# EAGLE design ArduSense_V0_3_5 (EAGLE 7.2.0)
AUTHOR: Joaquin Vaquero
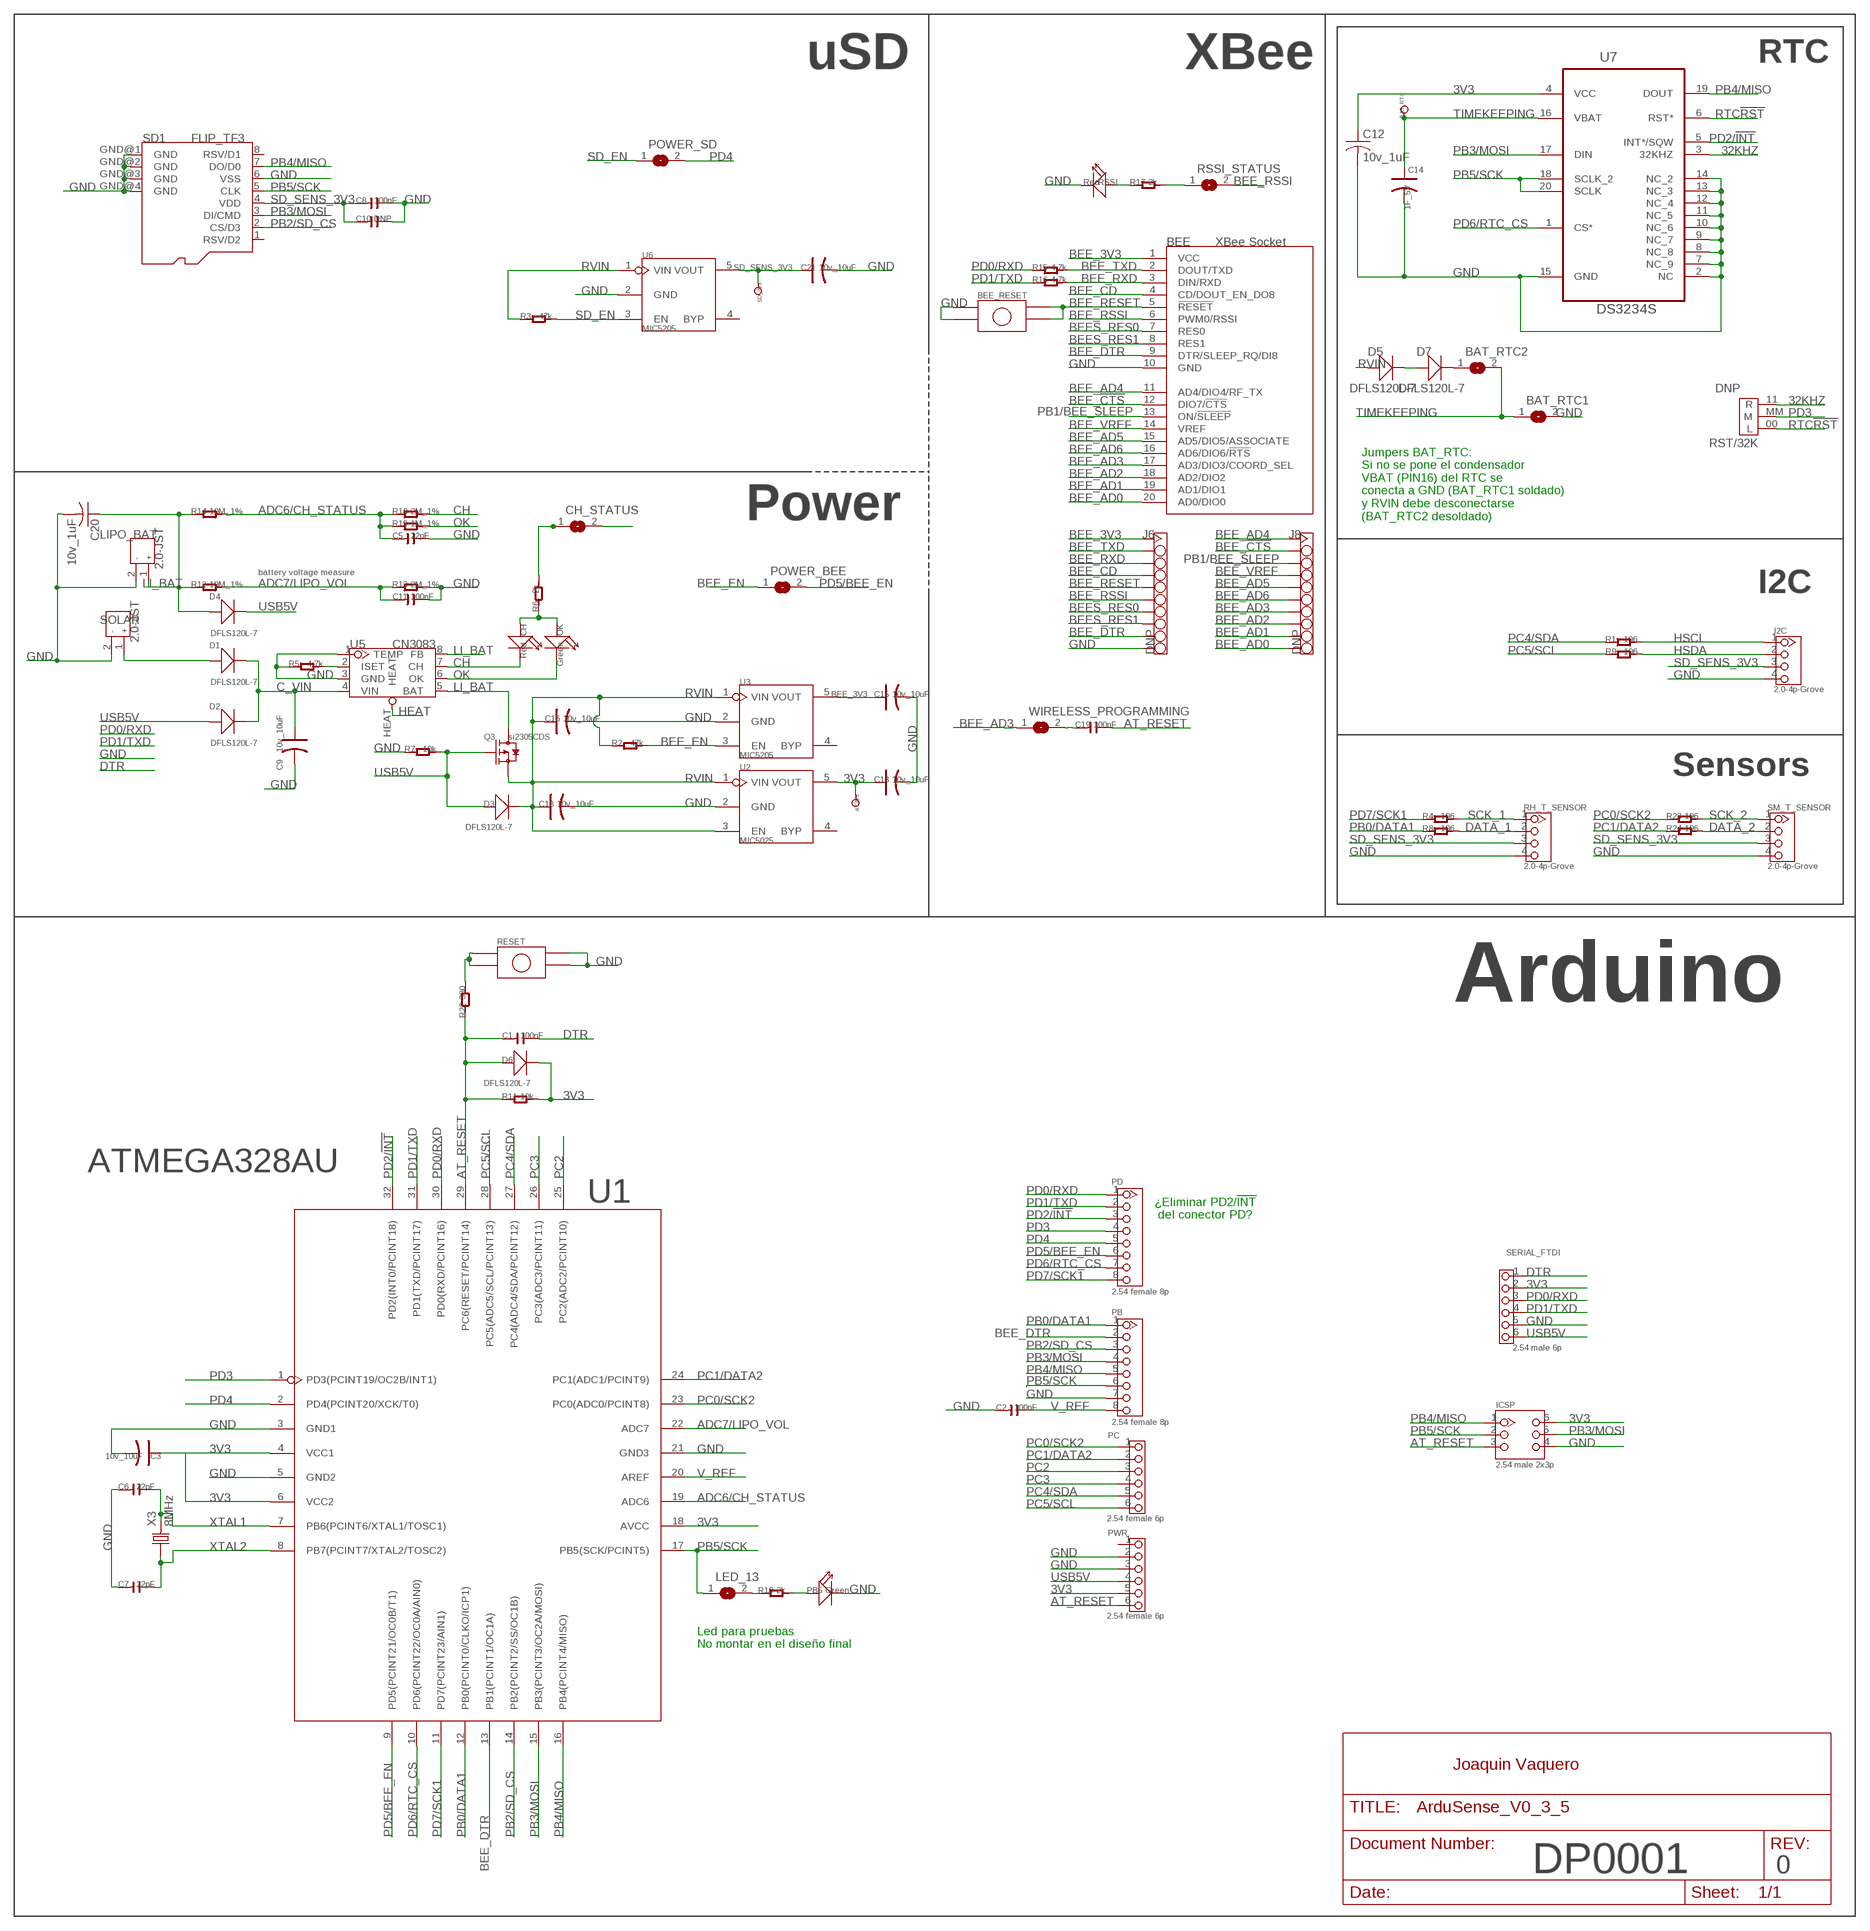
[diagram p0: schematic, sheet 1]

## Parts
AT3V3  DNP  TEST_POINT_SIZE_3030  [TP_3535]
BAT_RTC  DNP  TEST_POINT_SIZE_3030  [TP_3535]
BAT_RTC1  SJ  [SJ]
BAT_RTC2  SJ  [SJ]
BEE  XBee Socket  BEEO  [BEE]
BEE_RESET  PUSH_BUTTON  [PBUTTON_SMD]
C1  100nF  C-1206  [C1206]
C2  100nF  C-1206  [C1206]
C3  10v_10uF  C-POLAR-A  [AVX-A]
C5  22pF  C-1206  [C1206]
C6  22pF  C-1206  [C1206]
C7  22pF  C-1206  [C1206]
C8  100nF  C-1206  [C1206]
C9  10v_10uF  C-POLAR-A  [AVX-A]
C10  DNP  C-1206  [C1206]
C11  100nF  C-1206  [C1206]
C12  10v_1uF  C-USC0805  [C0805]
C13  10v_10uF  C-POLAR-A  [AVX-A]
C14  1F_5V  C-POLAR-DP  [EB21,5D]
C15  10v_10uF  C-POLAR-A  [AVX-A]
C16  10v_10uF  C-POLAR-A  [AVX-A]
C18  10v_10uF  C-POLAR-A  [AVX-A]
C19  100nF  C-1206  [C1206]
C20  10v_1uF  C-USC0805  [C0805]
C21  10v_10uF  C-POLAR-A  [AVX-A]
CH  Red  007-LED1206  [D1206]
CH_STATUS  SJ  [SJ]
D1  DFLS120L-7  DPOWERDI123  [POWERDI123]
D2  DFLS120L-7  DPOWERDI123  [POWERDI123]
D3  DFLS120L-7  DPOWERDI123  [POWERDI123]
D4  DFLS120L-7  DPOWERDI123  [POWERDI123]
D5  DFLS120L-7  DPOWERDI123  [POWERDI123]
D6  DFLS120L-7  DPOWERDI123  [POWERDI123]
D7  DFLS120L-7  DPOWERDI123  [POWERDI123]
I2C  2.0-4p-Grove  TWIG-4P-2.0-2.0  [4P-2.0]
ICSP  2.54 male 2x3p  HEADER-2X3P-2.54  [2X3P-2.54-LEADED]
J6  DNP  HEADER_1X10DD  [HEADER_1X10]
J8  DNP  HEADER_1X10DD  [HEADER_1X10]
LED_13  SJ  [SJ]
LIPO_BAT  2.0-JST  JACK-JST-2P-PW2.0  [JST-2.0]
OK  Green  007-LED1206  [D1206]
PB  2.54 female 8p  HEADER-8P-2.54-LEADED  [8P-2.54-LEADED]
PB5  Green  007-LED1206  [D1206]
PC  2.54 female 6p  HEADER-6P-LEADED-2.54  [6P-2.54-LEADED]
PD  2.54 female 8p  HEADER-8P-2.54-LEADED  [8P-2.54-LEADED]
POWER_BEE  SJ  [SJ]
POWER_SD  SJ  [SJ]
PWR  2.54 female 6p  HEADER-6P-LEADED-2.54  [6P-2.54-LEADED]
Q3  si2305CDS  MOSFET-P-044021001  [SOT23]
R1  196  R-1206  [R1206]
R2  47k  R-1206  [R1206]
R3  47k  R-1206  [R1206]
R4  196  R-1206  [R1206]
R5  4.7k  R-1206  [R1206]
R6  2k  R-1206  [R1206]
R7  10k  R-1206  [R1206]
R8  196  R-1206  [R1206]
R9  196  R-1206  [R1206]
R10  2k  R-1206  [R1206]
R11  10k  R-1206  [R1206]
R12  10M_1%  R-1206  [R1206]
R13  2M_1%  R-1206  [R1206]
R14  10M_1%  R-1206  [R1206]
R15  4.7k  R-1206  [R1206]
R16  4.7k  R-1206  [R1206]
R17  2k  R-1206  [R1206]
R18  2M_1%  R-1206  [R1206]
R19  1M_1%  R-1206  [R1206]
R22  330  R-1206  [R1206]
R23  196  R-1206  [R1206]
R24  196  R-1206  [R1206]
RESET  PUSH_BUTTON  [PBUTTON_SMD]
RH_T_SENSOR  2.0-4p-Grove  TWIG-4P-2.0-2.0  [4P-2.0]
RSSI  Red  007-LED1206  [D1206]
RSSI_STATUS  SJ  [SJ]
RST/32K  DNP  JUMPER  [JUMPER]
SD1  FLIP_TF3  [FLIP_TF3]
SD_3V3  DNP  TEST_POINT_SIZE_3030  [TP_3535]
SERIAL_FTDI  2.54 male 6p  HEADER-6P-LEADED-2.54  [6P-2.54-LEADED]
SM_T_SENSOR  2.0-4p-Grove  TWIG-4P-2.0-2.0  [4P-2.0]
SOLAR  2.0-JST  JACK-JST-2P-PW2.0  [JST-2.0]
U1  ATMEGA328AU  ATMEGA168-20AU  [ATMEGA168-20AU]
U2  MIC5025  MIC5025_X.X  [SOT23-5]
U3  MIC5205  MIC5025_X.X  [SOT23-5]
U5  CN3083  [SOP8]
U6  MIC5205  MIC5025_X.X  [SOT23-5]
U7  DS3234S  [SOIC127P1032X265-20N]
WIRELESS_PROGRAMMING  SJ  [SJ]
X3  8MHz  011-CRYSTALHC49UP  [HC49UP]

## Nets
3V3: AT3V3.T C3.+ C12.1 C13.+ D6.- ICSP.6 PWR.5 R11.2 SERIAL_FTDI.2 U1.4(VCC1) U1.6(VCC2) U1.18(AVCC) U2.5(VOUT) U7.4(VCC)
32KHZ: RST/32K.11(R) U7.3(32KHZ)
ADC6/CH_STATUS: C5.1 R14.2 R18.1 R19.1 U1.19(ADC6)
ADC7/LIPO_VOL: C11.1 R12.2 R13.1 U1.22(ADC7)
AT_RESET: C1.1 C19.2 D6.+ ICSP.3 PWR.6 R11.1 R22.1 U1.29(PC6(RESET/PCINT14))
BEE_3V3: BEE.1(VCC) C15.+ J6.1 U3.5(VOUT)
BEE_!CTS: BEE.12(DIO7/!CTS) J8.2
BEE_AD0: BEE.20(AD0/DIO0) J8.10
BEE_AD1: BEE.19(AD1/DIO1) J8.9
BEE_AD2: BEE.18(AD2/DIO2) J8.8
BEE_AD3: BEE.17(AD3/DIO3/COORD_SEL) J8.7 WIRELESS_PROGRAMMING.1
BEE_AD4: BEE.11(AD4/DIO4/RF_TX) J8.1
BEE_AD5: BEE.15(AD5/DIO5/ASSOCIATE) J8.5
BEE_AD6: BEE.16(AD6/DIO6/!RTS) J8.6
BEE_CD: BEE.4(CD/DOUT_EN_DO8) J6.4
BEE_DTR: BEE.9(DTR/SLEEP_RQ/DI8) J6.9 PB.2 U1.13(PB1(PCINT1/OC1A))
BEE_EN: POWER_BEE.1 R2.2 U3.3(EN)
BEE_RESET: BEE.5(!RESET) BEE_RESET.3 BEE_RESET.4 J6.5
BEE_RSSI: BEE.6(PWM0/RSSI) J6.6 RSSI_STATUS.2
BEE_RXD: BEE.3(DIN/RXD) J6.3 R16.2
BEE_TXD: BEE.2(DOUT/TXD) J6.2 R15.2
BEE_VREF: BEE.14(VREF) J8.4
BEES_RES0: BEE.7(RES0) J6.7
BEES_RES1: BEE.8(RES1) J6.8
C_VIN: C9.+ CH_STATUS.2 D1.- D2.- U5.4(VIN)
CH: CH.- R18.2 U5.7(CH)
DATA_1: R8.2 RH_T_SENSOR.2
DATA_2: R24.2 SM_T_SENSOR.2
DTR: C1.2 SERIAL_FTDI.1
GND: BAT_RTC1.2 BEE.10(GND) BEE_RESET.1 BEE_RESET.2 C2.1 C3.- C5.2 C6.1 C7.1 C8.2 C9.- C10.2 C11.2 C12.6+ C13.- C14.- C15.- C16.- C18.- C20.6+ C21.- I2C.4 ICSP.4 J6.10 LIPO_BAT.2 PB5.- PB.7 PWR.2 PWR.3 R5.1 R7.1 R13.2 RESET.3 RESET.4 RH_T_SENSOR.4 RSSI.- SD1.6(VSS) SD1.GND@1(GND) SD1.GND@2(GND) SD1.GND@3(GND) SD1.GND@4(GND) SERIAL_FTDI.5 SM_T_SENSOR.4 SOLAR.2 U1.3(GND1) U1.5(GND2) U1.21(GND3) U2.2(GND) U3.2(GND) U5.1(TEMP) U5.3(GND) U6.2(GND) U7.2(NC) U7.7(NC_9) U7.8(NC_8) U7.9(NC_7) U7.10(NC_6) U7.11(NC_5) U7.12(NC_4) U7.13(NC_3) U7.14(NC_2) U7.15(GND)
HEAT: U5.HEAT
HSCL: I2C.1 R1.2
HSDA: I2C.2 R9.2
LI_BAT: C20.1 D4.+ LIPO_BAT.1 Q3.3(D) R12.1 R14.1 U5.5(BAT) U5.8(FB)
N$1: PB5.+ R10.2
N$2: D5.- D7.+
N$3: D1.+ SOLAR.1
N$4: R22.2 RESET.1 RESET.2
N$5: R5.2 U5.2(ISET)
N$6: R17.1 RSSI.+
N$7: R17.2 RSSI_STATUS.1
N$8: CH.+ OK.+ R6.1
N$9: BAT_RTC2.1 D7.-
N$10: C19.1 WIRELESS_PROGRAMMING.2
N$11: LED_13.2 R10.1
N$12: CH_STATUS.1 R6.2
OK: OK.- R19.2 U5.6(OK)
PB0/DATA1: PB.1 R8.1 U1.12(PB0(PCINT0/CLKO/ICP1))
PB1/BEE_SLEEP: BEE.13(ON/!SLEEP) J8.3
PB2/SD_CS: PB.3 SD1.2(CS/D3) U1.14(PB2(PCINT2/SS/OC1B))
PB3/MOSI: ICSP.5 PB.4 SD1.3(DI/CMD) U1.15(PB3(PCINT3/OC2A/MOSI)) U7.17(DIN)
PB4/MISO: ICSP.1 PB.5 SD1.7(DO/D0) U1.16(PB4(PCINT4/MISO)) U7.19(DOUT)
PB5/SCK: ICSP.2 LED_13.1 PB.6 SD1.5(CLK) U1.17(PB5(SCK/PCINT5)) U7.18(SCLK_2) U7.20(SCLK)
PC0/SCK2: PC.1 R23.1 U1.23(PC0(ADC0/PCINT8))
PC1/DATA2: PC.2 R24.1 U1.24(PC1(ADC1/PCINT9))
PC2: PC.3 U1.25(PC2(ADC2/PCINT10))
PC3: PC.4 U1.26(PC3(ADC3/PCINT11))
PC4/SDA: PC.5 R1.1 U1.27(PC4(ADC4/SDA/PCINT12))
PC5/SCL: PC.6 R9.1 U1.28(PC5(ADC5/SCL/PCINT13))
PD0/RXD: PD.1 R15.1 SERIAL_FTDI.3 U1.30(PD0(RXD/PCINT16))
PD1/TXD: PD.2 R16.1 SERIAL_FTDI.4 U1.31(PD1(TXD/PCINT17))
PD2/!INT: PD.3 U1.32(PD2(INT0/PCINT18)) U7.5(INT*/SQW)
PD3: PD.4 RST/32K.MM(M) U1.1(PD3(PCINT19/OC2B/INT1))
PD4: PD.5 POWER_SD.2 U1.2(PD4(PCINT20/XCK/T0))
PD5/BEE_EN: PD.6 POWER_BEE.2 U1.9(PD5(PCINT21/OC0B/T1))
PD6/RTC_CS: PD.7 U1.10(PD6(PCINT22/OC0A/AIN0)) U7.1(CS*)
PD7/SCK1: PD.8 R4.1 U1.11(PD7(PCINT23/AIN1))
RTC!RST: RST/32K.00(L) U7.6(RST*)
RVIN: C16.+ C18.+ D3.- D5.+ Q3.2(S) R2.1 R3.1 U2.1(VIN) U2.3(EN) U3.1(VIN) U6.1(VIN)
SCK_1: R4.2 RH_T_SENSOR.1
SCK_2: R23.2 SM_T_SENSOR.1
SD_EN: POWER_SD.1 R3.2 U6.3(EN)
SD_SENS_3V3: C8.1 C10.1 C21.+ I2C.3 RH_T_SENSOR.3 SD1.4(VDD) SD_3V3.T SM_T_SENSOR.3 U6.5(VOUT)
TIMEKEEPING: BAT_RTC1.1 BAT_RTC2.2 BAT_RTC.T C14.+ U7.16(VBAT)
USB5V: D2.+ D3.+ D4.- PWR.4 Q3.1(G) R7.2 SERIAL_FTDI.6
V_REF: C2.2 PB.8 U1.20(AREF)
XTAL1: C6.2 U1.7(PB6(PCINT6/XTAL1/TOSC1)) X3.2
XTAL2: C7.2 U1.8(PB7(PCINT7/XTAL2/TOSC2)) X3.1
Unconnected: PWR.1 SD1.1(RSV/D2) SD1.8(RSV/D1) U2.4(BYP) U3.4(BYP) U6.4(BYP)

## Notes on the sheet
- uSD | XBee | RTC
- Power
- Jumpers BAT_RTC:
  Si no se pone el condensador 
  VBAT (PIN16) del RTC se 
  conecta a GND (BAT_RTC1 soldado)
  y RVIN debe desconectarse
  (BAT_RTC2 desoldado)
- battery voltage measure
- I2C
- Sensors
- Arduino
- ¿Eliminar PD2/!INT
   del conector PD?
- Led para pruebas
  No montar en el diseño final
- DP0001 | 0

## Library data of the parts
AT3V3 BAT_RTC SD_3V3 = CEI_Bio_Tic:TEST_POINT
BAT_RTC1 BAT_RTC2 CH_STATUS LED_13 POWER_BEE POWER_SD RSSI_STATUS WIRELESS_PROGRAMMING = jumper:SJ: SMD solder JUMPER
BEE = CEI_Bio_Tic:BEE
BEE_RESET RESET = CEI_Bio_Tic:PUSH_BUTTON
C1 C2 C5-C8 C10 C11 C19 = CEI_Bio_Tic:C*
C3 C9 C13-C16 C18 C21 = CEI_Bio_Tic:C-POLAR*
C12 C20 = rcl:C-US: CAPACITOR, American symbol
CH OK PB5 RSSI = CEI_Bio_Tic:007-LED*
D1-D7 = CEI_Bio_Tic:D*: DIODE
I2C RH_T_SENSOR SM_T_SENSOR = CEI_Bio_Tic:TWIG-4P-2.0
ICSP = CEI_Bio_Tic:HEADER-2X3P
J6 J8 = CEI_Bio_Tic:HEADER_1X10
LIPO_BAT SOLAR = CEI_Bio_Tic:JACK-JST-2P-PW
PB PD = CEI_Bio_Tic:HEADER-8P
PC PWR SERIAL_FTDI = CEI_Bio_Tic:HEADER-6P
Q3 = CEI_Bio_Tic:MOSFET-P: CJ2305:SMD MOSFET P-CH 8V-4.1A
R1-R19 R22-R24 = CEI_Bio_Tic:R*
RST/32K = CEI_Bio_Tic:JUMPER
SD1 = CEI_Bio_Tic:FLIP_TF3
U1 = CEI_Bio_Tic:ATMEGA168-20AU
U2 U3 U6 = CEI_Bio_Tic:MIC5025_X.X
U5 = CEI_Bio_Tic:CN3083
U7 = CEI_Bio_Tic:DS3234S: Extremely Accurate SPI Bus RTC with Integrated Crystal and SRAM; MPN: DS3234S#; OC_FARNELL: 1593294; OC_NEWARK: 74K5054; PACKAGE: SOIC-20; SUPPLIER: MAXIM INTEGRATED PRODUCTS
X3 = CEI_Bio_Tic:011-CRYSTAL*: CRYSTAL

## Net classes
0 default: width 0.152 mm, drill 0.305 mm, clearance 0.152 mm

## Board
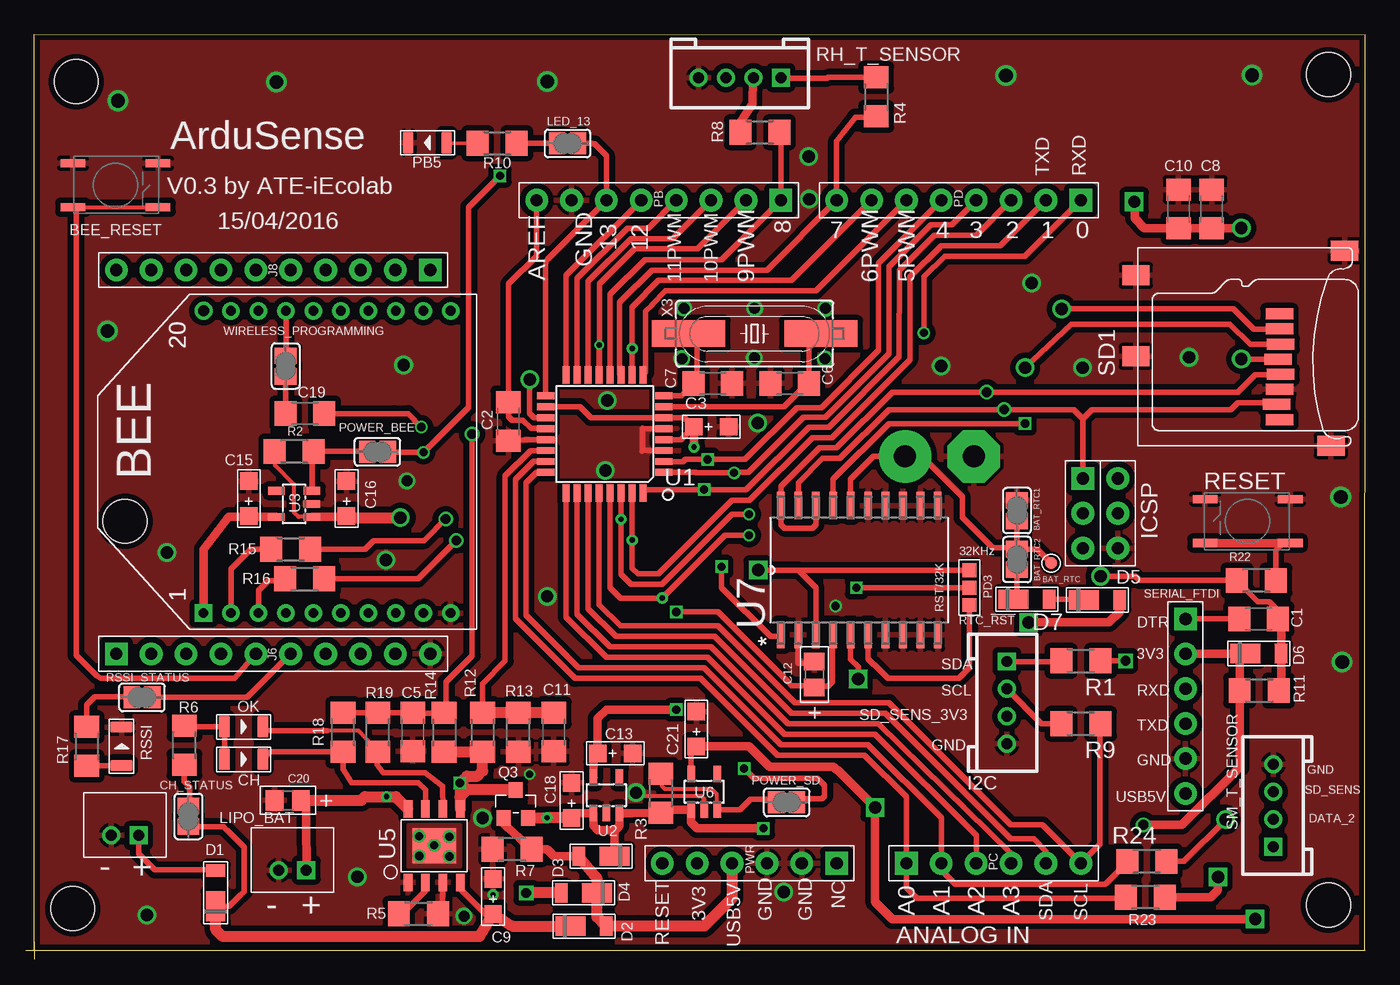
[diagram p1: board, top side]
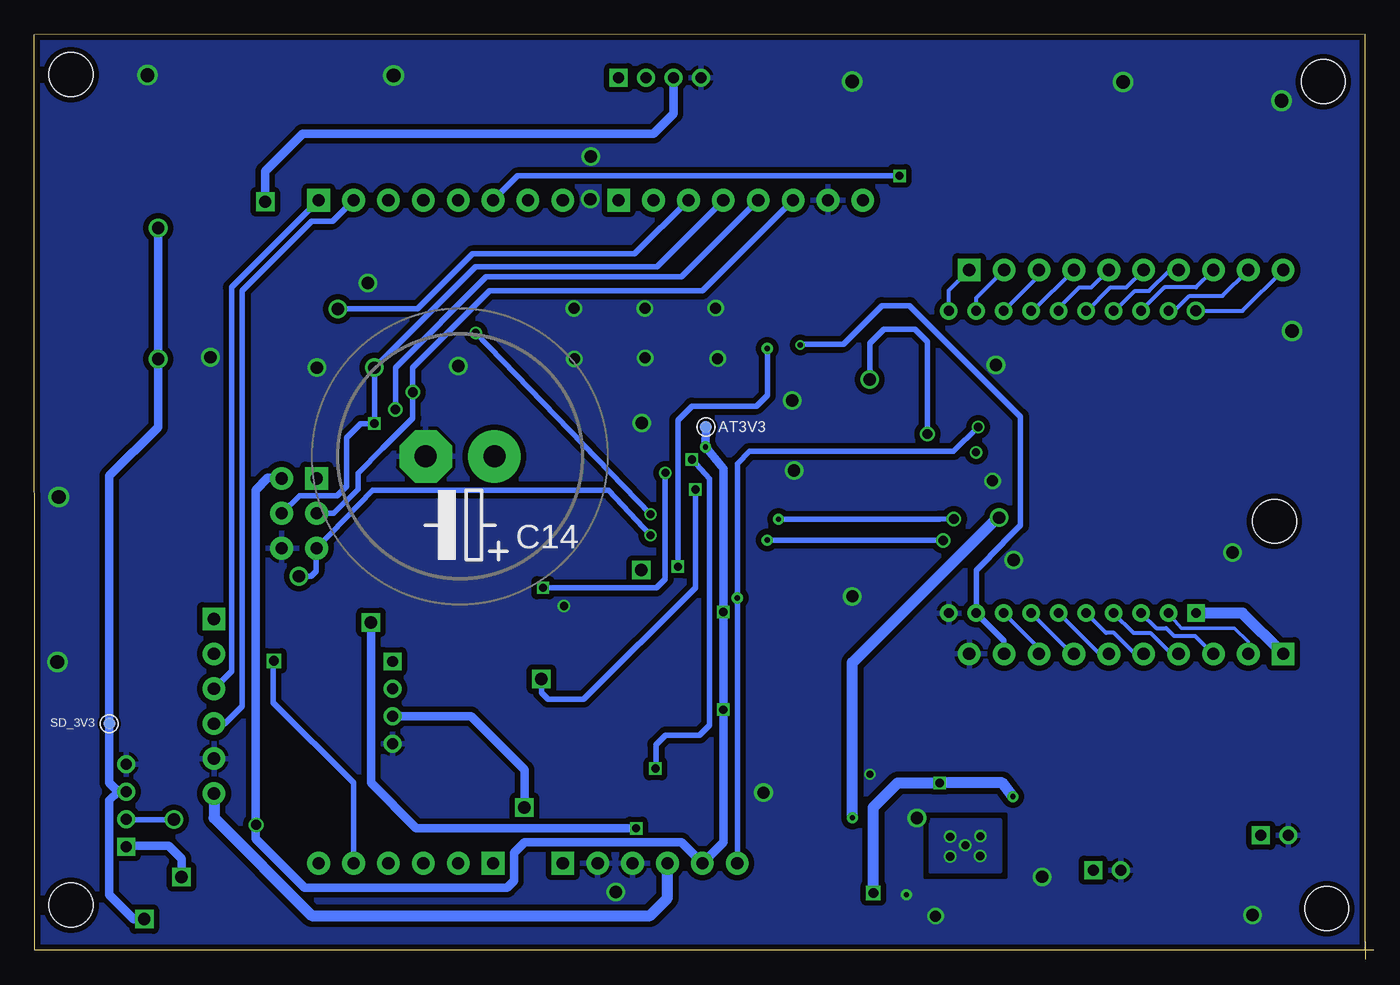
[diagram p2: board, bottom side, seen from below]

Size 96.9 x 66.68 mm. Coordinates in mm from the lower left corner, seen from the top.
Outline: 96.9,66.66 0,66.68 0,0 96.89,0
Outline: 96.89,0 96.9,66.65
Outline: 96.89,0 96.9,0
Copper layers (1*16): Top 0.035mm / dielectric 1.5mm / Bottom 0.035mm
Design rules "para fabricacion externa de 6mm": minimum track width 6mil, minimum drill 12mil, track to track 6mil, track to pad 6mil, pad to pad 6mil, via to via 6mil, smd to smd 0mil, copper to edge 10mil, drill to drill 10mil, minimum pad ring 10mil, minimum via ring 6mil, stop-mask expansion 2mil, vias tented up to drill 100mil, thermal gap 10mil
Holes 3.2 mm at 94.23,63.75 3.05,63.25 2.79,3.05 6.6,31.24 94.23,3.3
Milling: 2 lines

### Footprints (pad centres in the part's own frame; a part is rotated, then mirrored left to right if it is on the bottom)
TP_3535 = smd 0.889 x 0.889: T 0,0
SJ = smd 1.168 x 1.6: 1 -0.762,0; 2 0.762,0
BEE = drill 0.711 pad 1.27 square: 1 -11,0 | drill 0.711 pad 1.27: 2 -11,-2; 3 -11,-4; 4 -11,-6; 5 -11,-8; 6 -11,-10; 7 -11,-12; 8 -11,-14; 9 -11,-16; 10 -11,-18; 11 11,-18; 12 11,-16; 13 11,-14; 14 11,-12; 15 11,-10; 16 11,-8; 17 11,-6; 18 11,-4; 19 11,-2 | drill 0.8 pad 1.27: 20 11,0
PBUTTON_SMD = smd 1.8 x 0.6: 1 -3.1,-1.6; 2 3.1,-1.6; 3 -3.1,1.6; 4 3.1,1.6
C1206 = smd 1.6 x 1.8: 1 -1.4,0; 2 1.4,0
AVX-A = smd 1.27 x 1.27: + -1.27,0; - 1.27,0
C0805 = smd 1.3 x 1.5: 1 -0.95,0; 6+ 0.95,0
EB21,5D = drill 1.6 pad 3.81: + -2.5,0 | drill 1.6 pad 3.81 octagon: - 2.5,0
D1206 = smd 0.8 x 1.6: + -1.4,0; - 1.4,0
POWERDI123 = smd 0.9 x 1.4: + -1,0 | smd 2.2 x 1.4: - 1.6,0
4P-2.0 = drill 0.8 pad 1.27 square: 1 -3,0 | drill 0.8 pad 1.27: 2 -1,0; 3 1,0; 4 3,0
2X3P-2.54-LEADED = drill 0.889 pad 1.651 square: 1 -1.27,2.54 | drill 0.889 pad 1.651: 2 -1.27,0; 3 -1.27,-2.54; 4 1.27,-2.54; 5 1.27,0; 6 1.27,2.54
HEADER_1X10 = drill 0.889 pad 1.651 square: 1 0,11.43 | drill 0.889 pad 1.651: 2 0,8.89; 3 0,6.35; 4 0,3.81; 5 0,1.27; 6 0,-1.27; 7 0,-3.81; 8 0,-6.35; 9 0,-8.89; 10 0,-11.43
JST-2.0 = drill 0.8 pad 1.3 square: 1 -1,0.75 | drill 0.8 pad 1.3: 2 1,0.75
8P-2.54-LEADED = drill 0.889 pad 1.651 square: 1 0,8.89 | drill 0.889 pad 1.651: 2 0,6.35; 3 0,3.81; 4 0,1.27; 5 0,-1.27; 6 0,-3.81; 7 0,-6.35; 8 0,-8.89
6P-2.54-LEADED = drill 0.889 pad 1.651 square: 1 0,6.35 | drill 0.889 pad 1.651: 2 0,3.81; 3 0,1.27; 4 0,-1.27; 5 0,-3.81; 6 0,-6.35
SOT23 = smd 1.016 x 1.143: 1 -0.889,-1.016; 2 0.889,-1.016; 3 0,1.016
R1206 = smd 1.6 x 1.803: 1 -1.422,0; 2 1.422,0
JUMPER = smd 1.016 x 1.016: 00 -1.27,0; 11 1.27,0; MM 0,0
FLIP_TF3 = smd 0.8 x 2: 1 2.4,-2.39; 2 1.3,-2.39; 3 0.2,-2.49; 4 -0.9,-2.29; 5 -2,-2.49; 6 -3.1,-2.39; 7 -4.2,-2.19; 8 -5.3,-2.39 | smd 1.45 x 2: GND@1 -0.7,8.06; GND@2 -7.2,-6.14; GND@3 7,-7.14; GND@4 5.2,8.06
ATMEGA168-20AU = smd 1.27 x 0.508: 1 -4.293,2.8; 2 -4.293,2; 3 -4.293,1.2; 4 -4.293,0.4; 5 -4.293,-0.4; 6 -4.293,-1.2; 7 -4.293,-2; 8 -4.293,-2.8; 17 4.293,-2.8; 18 4.293,-2; 19 4.293,-1.2; 20 4.293,-0.4; 21 4.293,0.4; 22 4.293,1.2; 23 4.293,2; 24 4.293,2.8 | smd 0.508 x 1.27: 9 -2.8,-4.293; 10 -2,-4.293; 11 -1.2,-4.293; 12 -0.4,-4.293; 13 0.4,-4.293; 14 1.2,-4.293; 15 2,-4.293; 16 2.8,-4.293; 25 2.8,4.293; 26 2,4.293; 27 1.2,4.293; 28 0.4,4.293; 29 -0.4,4.293; 30 -1.2,4.293; 31 -2,4.293; 32 -2.8,4.293
SOT23-5 = smd 0.55 x 1.2: 1 -0.95,-1.3; 2 0,-1.3; 3 0.95,-1.3; 4 0.95,1.3; 5 -0.95,1.3
SOP8 = smd 0.635 x 1.27: 1 -1.905,-2.667; 2 -0.635,-2.667; 3 0.635,-2.667; 4 1.905,-2.667; 5 1.905,2.667; 6 0.635,2.667; 7 -0.635,2.667; 8 -1.905,2.667 | smd 3.175 x 2.54: HEAT 0,0
SOIC127P1032X265-20N = smd 1.981 x 0.559: 1 -4.699,5.715; 2 -4.699,4.445; 3 -4.699,3.175; 4 -4.699,1.905; 5 -4.699,0.635; 6 -4.699,-0.635; 7 -4.699,-1.905; 8 -4.699,-3.175; 9 -4.699,-4.445; 10 -4.699,-5.715; 11 4.699,-5.715; 12 4.699,-4.445; 13 4.699,-3.175; 14 4.699,-1.905; 15 4.699,-0.635; 16 4.699,0.635; 17 4.699,1.905; 18 4.699,3.175; 19 4.699,4.445; 20 4.699,5.715
HC49UP = smd 5.334 x 1.93: 1 -4.826,0; 2 4.826,0

### Placement (x,y rotation side)
AT3V3  48.01,38.1 0 bottom
BAT_RTC  74.04,28.19 90 top
BAT_RTC1  71.56,32.02 90 top
BAT_RTC2  71.56,28.46 90 top
BEE  12.32,35.56 90 top
BEE_RESET  5.91,55.7 180 top
C1  89.15,24.13 180 top
C2  34.52,38.51 90 top
C3  49.28,38.12 0 top
C5  27.56,15.9 270 top
C6  54.99,41.27 0 top
C7  49.4,41.27 180 top
C8  85.72,53.98 90 top
C9  33.4,3.94 90 top
C10  83.31,53.98 90 top
C11  37.82,15.9 270 top
C12  56.79,20.09 90 top
C13  42.29,14.35 0 top
C14  65.91,35.97 180 bottom
C15  15.62,32.89 90 top
C16  22.73,32.89 90 top
C18  39.12,10.92 90 top
C19  19.7,39.08 0 top
C20  18.46,10.92 180 top
C21  48.2,16.12 90 top
CH  15.24,13.91 0 top
CH_STATUS  11.22,9.76 270 top
D1  13.21,4.83 270 top
D2  40.64,1.78 180 top
D3  40.64,6.86 0 top
D4  39.37,4.19 0 top
D5  78.03,25.51 180 top
D6  89.78,21.62 180 top
D7  72.9,25.56 180 top
I2C  70.82,18.03 270 top
ICSP  77.62,31.82 0 top
J6  17.4,21.59 90 top
J8  17.4,49.53 270 top
LED_13  38.82,58.74 180 top
LIPO_BAT  18.8,6.6 180 top
OK  15.24,16.28 0 top
PB  45.47,54.61 270 top
PB5  28.62,58.79 180 top
PC  69.85,6.35 90 top
PD  67.31,54.61 270 top
POWER_BEE  24.98,36.3 0 top
POWER_SD  54.78,10.78 0 top
PWR  52.07,6.35 270 top
Q3  35.05,10.67 0 top
R1  76.2,21.08 180 top
R2  18.92,36.32 0 top
R3  45.62,11.46 90 top
R4  61.3,62.13 90 top
R5  27.96,2.67 180 top
R6  10.92,14.94 270 top
R7  34.8,7.37 0 top
R8  52.83,59.56 180 top
R9  76.2,16.51 180 top
R10  33.71,58.75 180 top
R11  89.18,18.92 180 top
R12  32.64,15.88 90 top
R13  35.24,15.88 270 top
R14  29.84,15.88 90 top
R15  18.67,29.21 180 top
R16  19.68,27.05 180 top
R17  3.81,14.86 90 top
R18  22.48,15.88 270 top
R19  25.02,15.88 270 top
R22  88.99,26.93 0 top
R23  80.91,3.87 0 top
R24  81,6.48 0 top
RESET  88.34,31.25 0 top
RH_T_SENSOR  51.36,63.53 180 top
RSSI  6.35,14.86 90 top
RSSI_STATUS  7.84,18.42 0 top
RST/32K  68.1,26.42 90 top
SD1  88.27,43.94 90 top
SD_3V3  91.44,16.51 0 bottom
SERIAL_FTDI  83.82,17.78 0 top
SM_T_SENSOR  90.2,10.56 90 top
SOLAR  6.6,9.13 180 top
U1  41.53,37.59 180 top
U2  41.66,11.3 0 top
U3  18.92,32.51 90 top
U5  29.11,7.62 0 top
U6  48.77,11.56 0 top
U7  60.07,27.69 90 top
WIRELESS_PROGRAMMING  18.3,42.54 270 top
X3  52.45,44.89 0 top

### Tracks (layer width: path | path; a pad name or v marks a point on that pad's centre or on a via)
3V3  (via drill 0.38 pad 0.81, 0.6, 0.71)
  Top 0.406: U1.4 47.1,37.19 AT3V3.T 48.01,36.69 v48.04,36.66 v48.03,36.65 | U1.18 39.72,39.59 40.52,38.79 U1.6 47.34,38.79 C3.+ 48.03,38.1 | v46.74,24.64 49.78,24.64 54.86,19.56 55.14,19.28 56.77,19.28 | U7.4 58.12,22.94 58.12,19.55 57.8,19.24 57.36,19.24 | 56.87,19.24 57.36,19.24 | 57.36,19.24 57.36,19.28 56.77,19.28 | 56.77,19.28 C12.1
  Top 0.61: U2.5 40.71,14.04 C13.+ 41.02,16.89 41.66,17.53 v46.74,17.53 | 88.16,21.59 87.76,21.19 R11.2 87.76,13.34 83.57,9.14 v80.75,9.14 | 88.16,21.59 D6.- | 88.16,21.59 SERIAL_FTDI.2 | v48.03,36.65 48.03,38.1
  Bottom 0.406: ICSP.6 78.93,34.4 | 80.8,33.5 80.8,33.4 80.77,33.37
  Bottom 0.61: AT3V3.T v48.03,36.65 46.74,35.08 v46.74,24.64 v46.74,17.53 46.74,7.87 PWR.5 49.78,7.87 61.21,7.87 61.98,7.11 61.98,5.08 62.48,4.57 77.22,4.57 80.77,8.13 80.77,9.12 | 80.77,9.12 80.77,33.37 | 80.77,9.12 v80.75,9.14 | 78.93,34.4 79.9,34.4 80.8,33.5
32KHZ  (via drill 0.9)
  Top 0.406: U7.3 56.9,26.42 55.63,27.69 v52.71,27.69 RST/32K.11
ADC6/CH_STATUS  (via drill 0.71 pad 0.81, 0.9 pad 0.81)
  Top 0.406: R18.1 R19.1 C5.1 27.59,17.27 29.36,17.27 | v31.88,37.59 31.88,21.46 29.97,19.56 29.97,17.27 29.36,17.27 | v36.07,41.55 36.07,39.12 36.39,38.79 U1.19 | R14.2 29.39,17.3 29.36,17.27
  Bottom 0.305: v31.88,37.59 31.88,37.62
  Bottom 0.406: 31.88,37.62 31.88,44.32 32.77,45.21 35.05,45.21 36.07,44.2 v36.07,41.55
ADC7/LIPO_VOL
  Top 0.406: R12.2 32.64,19.43 34.29,21.08 34.29,34.54 36.14,36.39 U1.22
  Top 0.813: R12.2 R13.1 C11.1
AT_RESET  (via drill 0.38 pad 0.81, 0.6, 0.6 pad 0.41, 0.9)
  Top 0.406: C1.1 90.55,24.77 89.92,25.4 89.1,25.4 R22.1 80.47,26.93 80.16,27.24 v77.63,27.24 | U1.29 41.91,32.77 41.91,26.42 42.67,25.65 v45.72,25.65 50.29,30.23 v52.04,30.23 | C19.2 26.18,39.08 27.2,39.08 v28.18,38.1
  Top 0.61: C1.1 90.78,23.9 D6.+ 90.78,19.1 R11.1
  Bottom 0.406: PWR.6 v45.72,25.65 45.72,35.43 44.83,36.32 29.97,36.32 28.19,38.1 v28.18,38.1 | v77.63,27.24 76.76,27.24 76.4,27.6 76.4,29.23 ICSP.3 72.26,33.5 55.09,33.5 v52.04,30.23
BEE_3V3
  Top 0.61: U3.5 15.11,31.56 | 15.11,31.56 14.16,31.56 12.32,29.21 BEE.1 | C15.+ 15.11,31.56
  Bottom 0.813: J6.1 8.94,24.56 BEE.1
BEE_!CTS
  Bottom 0.305: BEE.12 28.32,47.5 J8.2
BEE_AD0
  Bottom 0.305: BEE.20 8.94,46.56 J8.10
BEE_AD1
  Bottom 0.305: BEE.19 13.89,46.56 12.8,47.65 10.39,47.65 J8.9
BEE_AD2
  Bottom 0.305: J8.8 12.32,48.26 14.62,48.26 BEE.18
BEE_AD3
  Top 0.406: WIRELESS_PROGRAMMING.1 18.32,43.3 BEE.17
  Bottom 0.305: BEE.17 18.21,46.56 16.76,48.01 15.75,48.01 14.22,49.53 J8.7
  Bottom 0.406: 18.29,46.53 BEE.17
BEE_AD4
  Bottom 0.305: BEE.11 30.32,48.04 J8.1
BEE_AD5
  Bottom 0.305: BEE.15 22.32,46.77 20.83,48.26 19.94,48.26 J8.5
BEE_AD6
  Bottom 0.305: BEE.16 20.24,46.56 18.54,48.26 17.4,48.26 J8.6
BEE_CD
  Bottom 0.305: BEE.4 16.88,23.12 15.66,23.12 14.13,21.59 J6.4
BEE_DTR  (via drill 0.38)
  Top 0.406: PB.2 51.82,54.6 48.3,51.08 43.72,51.08 41.16,48.52 41.16,41.92 U1.13 41.13,44.07 v41.14,44.08
  Bottom 0.406: J6.9 26.29,22.53 BEE.9 28.32,27.68 26.34,29.66 26.34,29.7 25.1,30.94 25.1,38.86 33.18,46.94 35.2,46.94 38,44.14 41.06,44.14 41.12,44.08 v41.14,44.08
BEE_EN
  Top 0.406: U3.3 20.22,36.2 R2.2 24.22,36.32 POWER_BEE.1
BEE_RESET
  Top 0.305: 8.99,54.08 BEE_RESET.3 BEE_RESET.4
  Top 0.406: J6.5 14.61,19.81 4.83,19.81 4.53,20.01 3.05,21.49 3.05,53.86 BEE_RESET.4
  Bottom 0.305: J6.5 16.76,21.59 18.29,23.11 18.87,23.11 BEE.5
BEE_RSSI
  Top 0.406: J6.6 15.5,18.42 RSSI_STATUS.2
  Bottom 0.305: J6.6 19.35,21.59 BEE.6
BEE_RXD
  Top 0.406: BEE.3 16.32,26.23 17.02,26.92 18.14,26.92 R16.2
  Bottom 0.305: BEE.3 15.22,23.46 14.48,23.46 13.92,22.9 12.4,22.9 11.09,21.59 J6.3
BEE_TXD
  Top 0.406: BEE.2 14.32,27.78 15.75,29.21 R15.2
  Bottom 0.254: J6.2 8.51,22.48 9.53,23.44 13.4,23.46 BEE.2
BEE_VREF
  Bottom 0.305: BEE.14 24.18,46.56 J8.4
BEES_RES0
  Bottom 0.305: J6.7 21.35,21.59 BEE.7
BEES_RES1
  Bottom 0.305: J6.8 23.75,21.99 BEE.8
C_VIN
  Top 0.406: U5.4 31.02,4.44 32.84,2.62 33.35,2.62 C9.+ | D1.- 14.2,3.22 15.02,4.04 15.04,4.04 15.28,4.28 15.28,7.52 14.04,8.76 14.02,8.76 13.78,9 CH_STATUS.2
  Top 0.813: D2.- 34.8,1.78 C9.+ 32.38,1.02 13.72,1.02 13.21,1.52 D1.-
CH
  Top 0.406: U5.7 28.47,11.71 27.94,12.19 23.11,12.19 22.48,13.21 R18.2 22.45,14.48 17.21,14.48 CH.-
DATA_1
  Top 0.406: RH_T_SENSOR.2 52.32,63.49
  Top 0.61: 52.32,63.49 52.3,61.61 51.41,60.3 R8.2
DATA_2  (via drill 0.9)
  Top 0.406: R24.2 83.7,6.48 v86.74,9.53
  Bottom 0.406: v86.74,9.53 90.17,9.53 SM_T_SENSOR.2
DTR
  Top 0.406: SERIAL_FTDI.1 C1.2
GND  (via drill 0.38 pad 0.81, 0.5 pad 0.81, 0.6, 0.8, 0.8 pad 0.81, 0.9 pad 0.81, 1 pad 0.81)
  Top 0.254: U6.2 48.77,10.79
  Top 0.305: 48.77,10.79 48.77,10.97 48.76,10.98 48.76,11.06 48.6,11.22 44.07,11.22 v43.81,11.48
  Top 0.406: U1.21 35.71,37.19 C2.1 | 29.72,4.83 29.75,4.86 U5.3 29.72,4.92 29.72,3.3 29.64,2.97 R5.1 | U1.3 44.75,36.39 44.74,36.4 44.44,36.4 | 44.44,36.4 44.3,36.4 44.24,36.34 | U1.5 44.29,37.99 44.28,38 44.28,36.56 44.44,36.4 | U7.2 55.64,22.22 55.6,22.22 55.6,22.48 55.62,22.48 55.62,20.92 56.79,20.92 C12.6+
  other vias: 54.56,4.25 76.33,42.42 66.04,42.55 37.34,63.24 95.13,33 32.64,9.65 95.23,20.99 84.09,43.18 72.63,48.58 52.68,38.39 6.1,61.85 56.41,54.68 88.66,63.71 56.39,57.78 70.74,63.69 41.71,40.04 41.59,34.95 47.14,43.08 47.29,46.76 52.45,46.74 52.43,43.13 57.58,43.05 57.61,46.74 9.65,28.96 37.34,25.78 36.07,12.83 5.33,45.09 26.89,42.63 25.59,28.43 17.62,63.22 23.53,5.36 31.29,2.49 8.19,2.6 33.4,4.06 27.14,34.18 58.34,25.08
  pour Bottom (isolate 0.406, rank 6): 0,66.78 97.2,66.78 97.21,0 0,0
  pour Top (isolate 0.406, rank 6): 0,66.78 97.2,66.78 97.21,0 0,0
HEAT  (via drill 0.6 pad 0.81)
  other vias: 28.02,8.32 28.04,6.88 30.21,6.84 30.21,8.28 29.11,7.66
  pour Bottom (isolate 0.254): 26.57,9.53 31.66,9.53 31.66,5.71 26.57,5.71
  pour Top (isolate 0.254, no thermals): 27.21,9.14 31.02,9.14 31.02,6.1 27.21,6.1
HSCL
  Top 0.406: I2C.1 74.73,21.03 R1.2
HSDA
  Top 0.406: R9.2 73.34,16.51 I2C.2
LI_BAT  (via drill 0.38 pad 0.81, 0.6, 0.71)
  Top 0.406: 19.81,5.85 LIPO_BAT.1 | C20.1 19.8,10.92 | v25.65,11.2
  Top 0.61: 19.81,5.85 19.8,9.41 19.8,10.92
  Top 0.813: v25.64,11.19 v25.65,11.2 26.32,11.2 U5.8 | R14.1 R12.1 32.64,13.08 32.26,12.7 31.5,12.7 31.02,12.22 31.02,11.68 | U5.5 31.02,11.68 | Q3.3 31.5,11.68 | 31.5,11.68 31.02,11.68 | 31.5,11.68 30.99,11.18 | 31.5,11.68 v30.99,12.19 | D4.+ v35.81,4.19 | 19.8,10.92 23.8,10.92 24.08,11.2 v25.65,11.2
  Bottom 0.813: v25.65,11.2 26.42,12.19 v30.99,12.19 34.04,12.19 35.81,10.41 v35.81,4.19
N$1
  Top 0.305: PB5.+ R10.2
N$2
  Top 0.406: D7.+ 76.43,25.56 D5.- 76.5,25.58
N$3
  Top 0.406: SOLAR.1 7.6,7.04 8.78,5.86 13.18,5.86 D1.+
N$4
  Top 0.406: R22.2 90.41,29.13 90.93,29.65
  Top 0.61: RESET.2 90.93,29.65 RESET.1
N$5
  Top 0.406: U5.2 28.45,4.92 28.45,4.32 26.8,2.67 R5.2
N$6
  Top 0.406: R17.1 6.33,13.44 RSSI.+
N$7
  Top 0.406: R17.2 3.81,17.89 4.38,18.46 7.04,18.46 RSSI_STATUS.1
N$8
  Top 0.406: CH.+ OK.+ 11.01,16.28 R6.1
N$9
  Top 0.406: D7.- 71.55,26.16 BAT_RTC2.1
N$10
  Top 0.406: 18.3,39.89 C19.1 WIRELESS_PROGRAMMING.2
N$11
  Top 0.406: R10.1 38.06,58.75 LED_13.2
N$12
  Top 0.406: R6.2 10.92,12.28 11.3,11.9 11.3,10.6 CH_STATUS.1
OK
  Top 0.305: R19.2 23.6,16 21.34,16
  Top 0.406: U5.6 29.74,11.94 28.45,12.95 25.4,12.95 24.97,13.51 R19.2 | 21.34,16 16.92,16 OK.-
PB0/DATA1
  Top 0.406: U1.12 41.93,47.77 44.45,50.29 50.04,50.29 PB.1 54.36,59.46 R8.1
PB1/BEE_SLEEP
  Bottom 0.305: 23.75,49.13 BEE.13
  Bottom 0.406: J8.3 23.75,49.13
PB2/SD_CS  (via drill 0.9)
  Top 0.406: U1.14 40.33,48.71 43.43,51.82 46.48,51.82 PB.3 | 90.69,45.21 SD1.2 90.62,45.21 88.79,45.21 87.3,46.7 v74.8,46.7
  Bottom 0.406: PB.3 53.19,50.7 65,50.7 69,46.7 v74.8,46.7
PB3/MOSI  (via drill 0.6, 0.9 pad 0.41)
  Top 0.406: U1.15 39.53,47.91 39.52,47.92 39.52,48.92 43.18,52.58 44.7,52.58 PB.4 | U7.17 58.17,34.29 62.23,38.35 v72.14,38.35 | v72.14,42.42 75.52,45.6 87.03,45.6 88.53,44.14 SD1.3
  Bottom 0.406: PB.4 51.56,49.78 64.77,49.78 v72.14,42.42 v72.14,38.35 73.15,38.35 74.17,37.34 74.17,33.78 74.85,33.1 77.6,33.1 ICSP.5 78.89,31.85
PB4/MISO  (via drill 0.71 pad 0.81)
  Top 0.406: U1.16 38.73,49.14 PB.5 | U7.19 55.63,34.04 57.4,35.81 58.67,35.81 62.23,39.37 v70.61,39.37 75.69,39.37 76.35,38.71 | SD1.7 90.57,39.88 87.63,39.88 87.12,39.37 77.02,39.37 76.35,38.71 | 76.35,38.71 ICSP.1
  Bottom 0.406: PB.5 49.78,49.02 64.01,49.02 70.61,42.42 v70.61,39.37
PB5/SCK  (via drill 0.71 pad 0.41)
  Top 0.305: 91.5,41.91 91.47,41.94
  Top 0.406: U7.18 56.9,30.99 56.64,30.73 54.61,30.73 54.36,30.99 U7.20 54.36,33.78 57.15,36.58 58.42,36.58 62.48,40.64 v69.34,40.64 87.64,40.64 88.91,41.91 91.5,41.91 | 91.47,41.94 SD1.5 | U1.17 37.24,49.82 37.26,50.18 37.36,50.32 PB.6 | PB.6 41.7,54.61 | 39.62,58.78 LED_13.1 40.6,58.74 40.62,58.72 40.8,58.72 41.66,57.86 PB.6
  Bottom 0.406: PB.6 48.26,48.01 63.75,48.01 69.34,42.42 v69.34,40.64 69.34,38.76 70.9,37.2 71.53,36.55 73.34,34.75 73.34,33.58 75.1,31.82 ICSP.2
PC0/SCK2
  Top 0.406: U1.23 36.35,35.59 35.05,34.29 35.05,24.13 39.37,19.81 48.51,19.81 54.1,14.22 60.45,14.22 63.5,11.18 PC.1 63.5,4.57 64.26,3.81 79.42,3.81 R23.1
PC1/DATA2
  Top 0.406: 37.08,34.79 U1.24 36.58,34.8 35.81,34.04 35.81,24.38 39.62,20.57 48.77,20.57 54.36,14.99 60.71,14.99 66.04,9.65 PC.2 66.04,5.84 67.06,4.83 77.98,4.83 79.58,6.43 R24.1
PC2
  Top 0.406: PC.3 68.58,8.38 61.21,15.75 54.61,15.75 49.02,21.34 41.66,21.34 38.73,24.26 U1.25
PC3
  Top 0.406: PC.4 71.09,7.06 61.47,16.51 54.86,16.51 49.28,22.1 41.91,22.1 39.53,24.48 U1.26
PC4/SDA  (via drill 0.71)
  Top 0.406: U1.27 40.34,24.89 42.37,22.86 49.53,22.86 55.12,17.27 61.98,17.27 71.12,8.13 72.77,8.13 73.66,7.24 PC.5 | R1.1 v79.45,21.08
  Bottom 0.406: PC.5 73.66,12.19 79.5,18.03 79.5,21.03 v79.45,21.08
PC5/SCL
  Top 0.406: U1.28 41.13,25.16 42.67,23.62 49.78,23.62 55.37,18.03 62.23,18.03 71.12,9.14 73.41,9.14 PC.6 77.6,7.75 77.6,16.48 R9.1
PD0/RXD  (via drill 0.38 pad 0.81, 0.6, 0.6 pad 0.41, 0.71 pad 0.81)
  Top 0.406: PD.1 72.14,50.55 66.29,50.55 64.77,49.02 v64.77,44.96 | 42.75,33.28 U1.30 v42.72,31.39 42.72,27.38 43.43,26.67 45.72,26.67 50.8,31.75 v52.04,31.75 | R15.1 24.07,29.21 24.7,29.84 28.38,29.84 v29.95,31.41
  Bottom 0.406: PD.1 82.55,48.26 82.55,20.32 SERIAL_FTDI.3 | v52.04,31.75 v64.77,44.96 | v42.72,31.39 31.01,31.39 v29.95,31.41
PD1/TXD  (via drill 0.38 pad 0.81, 0.71 pad 0.81)
  Top 0.406: PD.2 70.36,51.31 66.04,51.31 63.75,49.02 63.75,43 58.09,37.34 56.64,37.34 52.07,32.77 50.8,32.77 45.47,27.43 43.94,27.43 43.54,27.84 v43.54,29.87 U1.31 | R16.1 27.94,27.05 v30.73,29.84
  Bottom 0.406: PD.2 75.18,53.09 76.71,53.09 81.79,48.01 81.79,17.78 83.06,16.51 SERIAL_FTDI.4 | v30.73,29.84 43.51,29.84 v43.54,29.87
PD2/!INT  (via drill 0.6, 0.9)
  Top 0.406: PD.3 68.58,52.07 65.53,52.07 62.99,49.53 62.97,43.2 57.86,38.1 56.39,38.1 51.82,33.53 49.02,33.53 | 49.02,33.53 44.56,33.53 U1.32 | U7.5 59.44,21.2 60,20.64 60,19.76 v59.99,19.75 | v48.77,33.55 49.02,33.55 49.02,33.53
  Bottom 0.406: v48.77,33.55 48.77,26.42 56.9,18.29 59.51,18.29 59.98,18.76 v59.98,19.75 v59.99,19.75
PD3  (via drill 0.6, 0.6 pad 0.41)
  Top 0.406: PD.4 66.8,52.83 65.28,52.83 62.23,49.78 62.23,43.43 57.61,38.81 56.01,38.81 51.99,34.79 50.9,34.79 v50.95,34.77 50.82,34.77 48.21,34.77 48.19,34.79 U1.1 | RST/32K.MM 59.88,26.42 v59.86,26.4
  Bottom 0.406: 50.9,34.72 v50.95,34.77 50.98,34.74 50.98,27.02 51.6,26.4 v59.86,26.4
PD4  (via drill 0.6)
  Top 0.406: PD.5 61.47,50.04 61.47,43.69 57.3,39.52 55.52,39.52 51.75,35.74 v49.02,35.74 | v49.02,35.74 48.95,35.74 47.42,35.74 47.24,35.56 45.85,35.56 U1.2 | v49.02,35.74 49.02,35.69 | v49.02,35.74 49.02,35.81 | v51.68,13.24 51.7,13.24 52.4,12.54 57.02,12.54 57.54,12.02 57.54,11.24 57.34,11.04 55.8,11.04 POWER_SD.2
  Bottom 0.406: v49.02,35.74 47.75,34.32 47.75,16.38 47.76,16.38 48.46,15.68 50.94,15.68 51.64,14.98 51.64,13.28 v51.68,13.24
PD5/BEE_EN  (via drill 0.6)
  Top 0.406: PD.6 56.9,48.01 45.97,48.01 44.96,47 44.96,46.98 44.52,46.54 44.52,42.08 U1.9 | v33.91,56.39 31.62,54.1 31.62,39.54 v28.34,36.26 25.78,36.26 POWER_BEE.2 25.76,36.32
  Bottom 0.406: v33.91,56.39 61.72,56.39 PD.6
PD6/RTC_CS  (via drill 0.38 pad 0.81, 0.6)
  Top 0.406: 43.53,43.69 43.53,46.83 45.47,48.77 55.12,48.77 PD.7 | v50.04,27.94 50.04,26.42 53.59,22.86 54.23,22.86 U7.1 | v43.54,43.81 43.54,43.7 43.53,43.69 | 43.53,43.69 U1.10
  Bottom 0.406: v50.04,27.94 50.04,38.61 49.02,39.62 44.32,39.62 43.54,40.41 v43.54,43.81
PD7/SCK1
  Top 0.406: R4.1 61.25,60.66 59.78,60.66 58.42,58.92 PD.8 53.34,49.53 44.96,49.53 42.73,47.3 42.73,47.29 42.62,47.18 42.62,41.99 U1.11
  Top 0.61: 61.19,60.6 R4.1
RTC!RST
  Top 0.406: U7.6 60.71,21.23 61.14,20.8 61.16,20.8 62.14,19.82 67.34,19.82 68.1,20.58 RST/32K.00
RVIN  (via drill 0.38 pad 0.81, 0.6, 0.9, 0.9 pad 0.81)
  Top 0.254: 79.1,25.97 79.1,25.2
  Top 0.305: U3.1 19.24,31.56 18.92,31.88 18.92,33.91 17.53,35.31 17.53,36.3 R2.1
  Top 0.406: 79.1,25.51 D5.+ 79,25.48 | 79.1,25.51 79.1,25.7 | 79.1,25.51 79.1,25.2 79.1,24.9 | 79.1,25.97 79.09,25.97 79.08,25.98 79.04,25.98 79,25.94 79,25.88 79.1,25.88 79.14,25.84 79.1,25.84 79,25.74 | 78.99,25.64 78.99,25.99 79,25.98 79,25.48 | 79,25.4 79,25.48
  Top 0.61: 42.61,9.08 U2.3 43.53,10 R3.1 46.11,10.26 U6.1 47.82,9.33 48.26,8.89 v53.09,8.89 | 42.61,9.08 42.29,8.76 42.24,8.76 | C18.+ 39.47,10 U2.1 40.71,9.08 41.02,8.76 42.24,8.76 | U3.1 22.67,31.56 | 42.61,9.08 42.24,8.76 | 42.24,8.76 D3.- | 22.86,31.5 C16.+ | v72.39,23.88 78.23,23.88 79.03,24.67 D5.+
  Top 0.813: Q3.2 v37.34,9.65 C18.+ | 22.67,31.56 C16.+ 22.86,31.62 | 22.86,31.5 v26.66,31.5
  Bottom 0.61: v53.09,8.89 69.09,8.89 72.39,12.19 v72.39,23.88
  Bottom 0.813: v37.34,9.65 37.34,20.95 26.79,31.5 v26.66,31.5
SCK_1
  Top 0.406: R4.2 57.79,63.55 57.74,63.5 54.38,63.5 RH_T_SENSOR.1
SCK_2  (via drill 0.9)
  Top 0.61: R23.2 85.66,3.87 86.18,4.39 v86.18,5.36
  Bottom 0.61: v86.18,5.36 86.19,5.41 86.19,6.68 87.12,7.62 90.14,7.62 SM_T_SENSOR.1
SD_EN
  Top 0.305: R3.2 45.68,12.82 45.68,11.98 45.9,11.76 49.32,11.76 49.68,11.4 49.68,10.29 U6.3
  Top 0.406: U6.3 51.02,10.26 51.31,10.26 51.38,10.26 52.14,11.02 53.78,11.02 POWER_SD.1
SD_SENS_3V3  (via drill 0.9, 0.9 pad 0.41)
  Top 0.406: SD1.4 87.89,43.04 v87.88,43.05 | U6.5 47.82,14.47 C21.+
  Top 0.61: v87.88,52.58 C8.1 C10.1 80.83,52.58 80.12,53.28 80.12,54.47 v80.09,54.5 | v88.9,2.29 62.48,2.29 61.21,3.56 v61.21,10.41 58.47,13.16 58.4,13.16 58.18,13.38 53.52,13.38 52.46,14.42 52.46,14.44 52.37,14.53 52.05,14.85 C21.+
  Bottom 0.61: RH_T_SENSOR.3 50.36,60.89 51.82,59.44 77.38,59.44 80.1,56.72 v80.1,54.5 v80.09,54.5 | v87.88,52.58 v87.88,43.05 87.88,38.1 91.44,34.54 SD_3V3.T 91.44,12.19 90.8,11.56 | I2C.3 65.09,17.03 61.21,13.15 v61.21,10.41 | SM_T_SENSOR.3 90.8,11.56 | 90.8,11.56 91.44,10.92 91.44,4.06 89.66,2.29 v88.9,2.29
TIMEKEEPING
  Top 0.406: U7.16 59.44,34.29 61.11,35.97 C14.+ 64.62,35.97 67.56,33.02 67.56,31.5 67.6,31.5 69.8,29.3 71.48,29.3 BAT_RTC2.2 | BAT_RTC.T 73.41,28.83 73.04,29.2 71.58,29.2 BAT_RTC2.2 | BAT_RTC1.1 BAT_RTC2.2
USB5V
  Top 0.61: Q3.1 34.16,9.27 34.54,8.89 R7.2 37.34,7.37 37.85,6.86 D3.+
  Top 0.813: D3.+ 40.97,5.26 D4.- 40.97,2.45 D2.+ 48.77,1.78 50.8,3.81 PWR.4
  Bottom 0.813: SERIAL_FTDI.6 83.82,9.65 76.71,2.54 52.07,2.54 50.8,3.81 PWR.4
V_REF
  Top 0.406: 34.52,39.67 C2.2 | C2.2 34.54,39.88 34.54,38.86 34.8,38.61 35.56,38.61 36.17,38 U1.20 | PB.8 36.58,50.55 34.54,48.51 34.54,39.93 C2.2
XTAL1
  Top 0.406: U1.7 54.58,39.59 55.88,40.89 56.01,40.89 C6.2 | C6.2 56.39,44.26 X3.2 | 56.26,41.15 C6.2 | 56.26,41.4 C6.2
XTAL2
  Top 0.406: 48.01,44.45 48.01,44.51 X3.1 | U1.8 46.98,40.39 46.99,40.39 47.11,40.39 C7.2 48.26,41.53 48.26,44.2 48.01,44.45 | 48,44.45 48.01,44.45

### Text on the board
tPlace: ArduSense | TXD | RXD | V0.3 by ATE-iEcolab | 15/04/2016 | 8 | 7 | 4 | 3 | 2 | 1 | 0 | 13 | 12 | GND | AREF | 11PWM | 10PWM | 9PWM | 6PWM | 5PWM | 32KHz | PD3 | RTC_!RST | DTR | 3V3 | SDA | SCL | RXD | SD_SENS_3V3 | TXD | GND | GND | GND | SD_SENS | USB5V | DATA_2 | - | + | NC | A0 | A1 | A2 | A3 | - | + | 3V3 | GND | GND | SDA | SCL | ANALOG IN | RESET | USB5V
tDocu: DATA_1 | SCK_1 | SCK_2